# EasyEDA schematic SCH_MODULO_CO2 (Ver 1.0)_2023-02-25.json
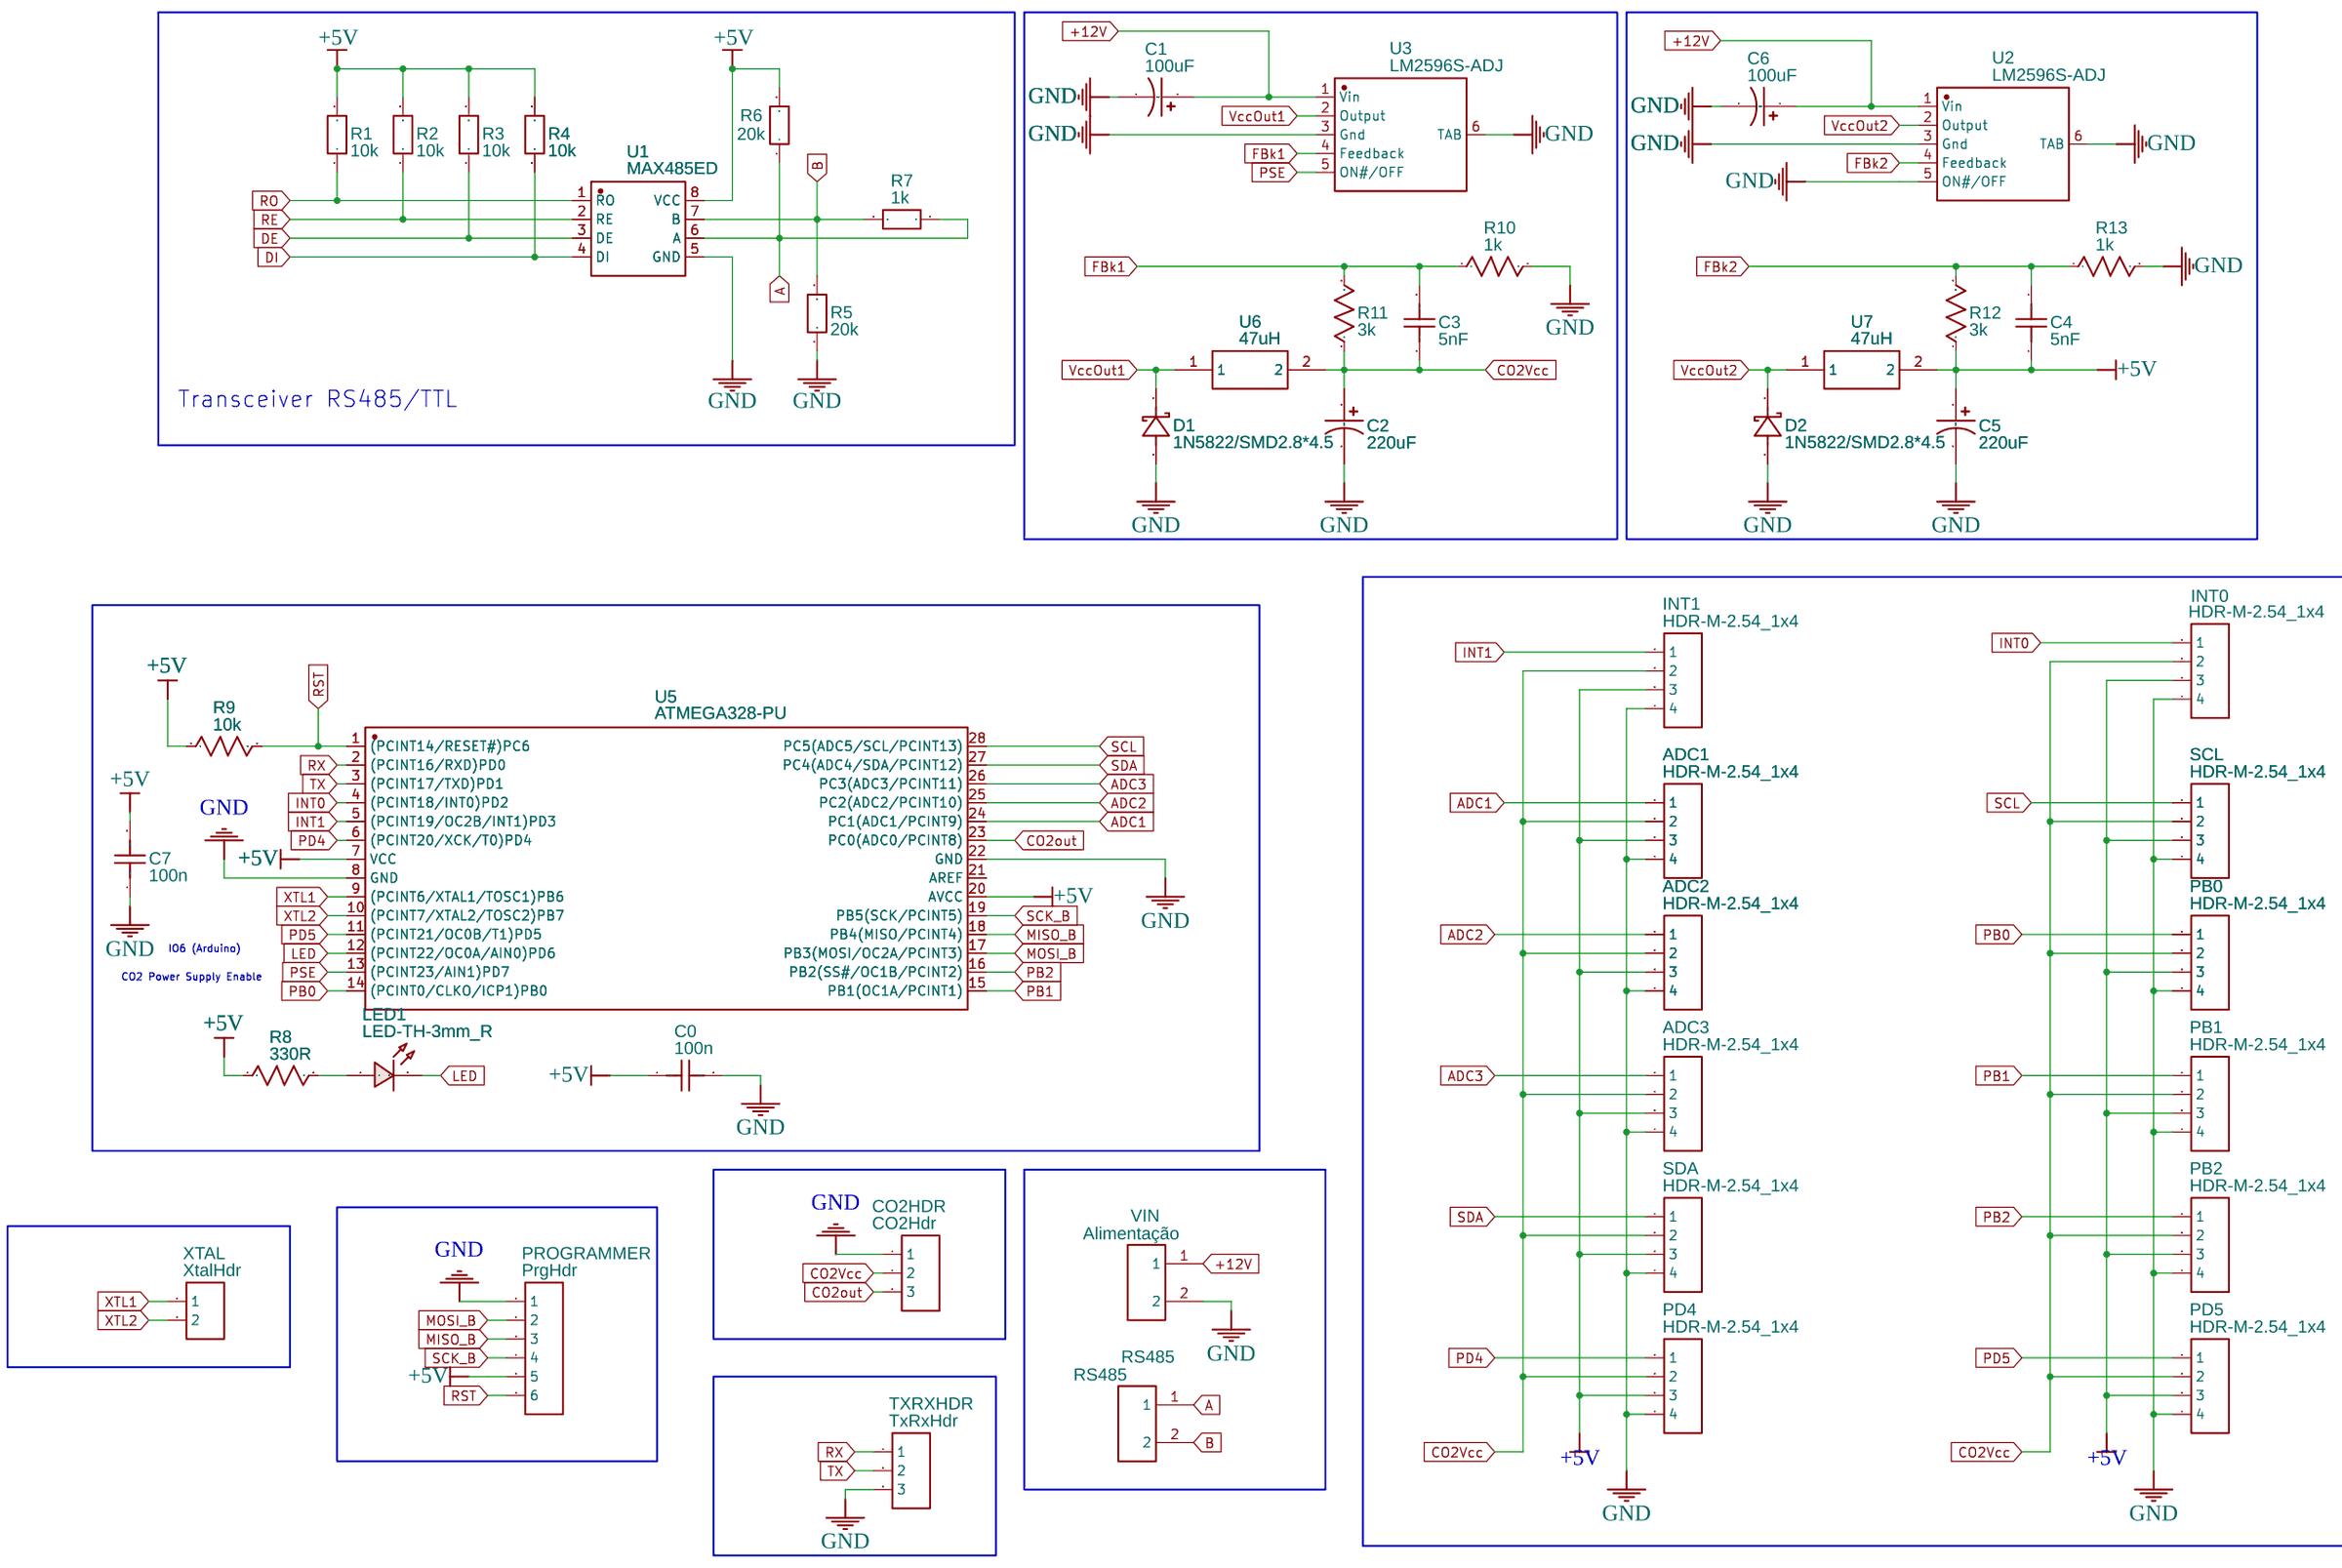
[diagram p0: schematic sheet]

## Parts
ADC1  HDR-M-2.54_1x4  [HDR-M-2.54_1X4]
ADC2  HDR-M-2.54_1x4  [HDR-M-2.54_1X4]
ADC3  HDR-M-2.54_1x4  [HDR-M-2.54_1X4]
C0  100n  [C1206]
C1  100uF  [CAP-D6.3×F2.5]
C2  220uF  [CAP-D6.3×F2.5]
C3  5nF  [C1206]
C4  5nF  [C1206]
C5  220uF  [CAP-D6.3×F2.5]
C6  100uF  [CAP-D6.3×F2.5]
C7  100n  [C1206]
CO2HDR  CO2Hdr  [HDR-F-2.54_1X3]
D1  1N5822/SMD2.8*4.5  [DO-214AC_L4.3-W2.7-LS5.0-RD]
D2  1N5822/SMD2.8*4.5  [DO-214AC_L4.3-W2.7-LS5.0-RD]
INT0  HDR-M-2.54_1x4  [HDR-M-2.54_1X4]
INT1  HDR-M-2.54_1x4  [HDR-M-2.54_1X4]
LED1  LED-TH-3mm_R  [D1206-S-RD]
PB0  HDR-M-2.54_1x4  [HDR-M-2.54_1X4]
PB1  HDR-M-2.54_1x4  [HDR-M-2.54_1X4]
PB2  HDR-M-2.54_1x4  [HDR-M-2.54_1X4]
PD4  HDR-M-2.54_1x4  [HDR-M-2.54_1X4]
PD5  HDR-M-2.54_1x4  [HDR-M-2.54_1X4]
PROGRAMMER  PrgHdr  [HDR-F-2.54_1X6]
R1  10k  [R1206]
R2  10k  [R1206]
R3  10k  [R1206]
R4  10k  [R1206]
R5  20k  [R1206]
R6  20k  [R1206]
R7  1k  [R1206]
R8  330R  [R1206]
R9  10k  [R1206]
R10  1k  [R1206]
R11  3k  [R1206]
R12  3k  [R1206]
R13  1k  [R1206]
RS485  RS485  [CONETOR VERDE 2 PINOS]
SCL  HDR-M-2.54_1x4  [HDR-M-2.54_1X4]
SDA  HDR-M-2.54_1x4  [HDR-M-2.54_1X4]
TXRXHDR  TxRxHdr  [HDR-F-2.54_1X3]
U1  MAX485ED  [SOP-8_L4.9-W3.9-P1.27-LS6.0-BL]
U2  LM2596S-ADJ  [TO-263-5_L10.2-W8.9-P1.70-BR]
U3  LM2596S-ADJ  [TO-263-5_L10.2-W8.9-P1.70-BR]
U5  ATMEGA328-PU  [DIP-28_L35.0-W6.5-P2.54-LS7.6-BL]
U6  47uH  [SMD_INDUCTOR_BIG]
U7  47uH  [SMD_INDUCTOR_BIG]
VIN  Alimentação  [CONETOR VERDE 2 PINOS]
XTAL  XtalHdr  [HDR-F-2.54_1X2]

## Library data of the parts
ADC1-ADC3 INT0 INT1 PB0-PB2 PD4 PD5 SCL SDA = HDR-M-2.54_1x4: Supplier Part: C124378; Supplier: LCSC; Contributor: LCEDA_Lib
C0 = C_RAD-0.1_US: Contributor: LCEDA_Lib
C1 C2 C5 C6 = CE_TH_D6.3×F2.5_US: Contributor: LCEDA_Lib
C3 C4 C7 = C_0603_US: Contributor: LCEDA_Lib
CO2HDR TXRXHDR = HDR-F-2.54_1x3: Supplier Part: C146690; Supplier: LCSC; Contributor: LCEDA_Lib
D1 D2 = 1N5822/SMD2.8*4.5: Supplier: LCSC; Supplier Part: C9900015672; Manufacturer: null; JLCPCB Part Class: Extended Part; Contributor: lcsc
LED1 = LED-TH-3mm_R: Manufacturer: EVERLIGHT(台湾亿光); Manufacturer Part: 204-10SDRD/S530-A3-L; Supplier Part: C84774; Supplier: LCSC; Contributor: LCEDA_Lib
PROGRAMMER = HDR-F-2.54_1x6: Supplier Part: C40877; Supplier: LCSC; Contributor: LCEDA_Lib
R1-R7 = R_1206_EU: Contributor: LCEDA_Lib
R8 R9 = R_AXIAL-0.3_US: Contributor: LCEDA_Lib
R10-R13 = R_1206_US: Contributor: LCEDA_Lib
RS485 VIN = conector verde 2 pinos: Contributor: jpcoelho1974
U1 = MAX485ED: Supplier: LCSC; Supplier Part: C481667; Manufacturer: HTC; Contributor: LCSC; JLCPCB Part Class: Extended Part
U2 U3 = LM2596S-ADJ: Supplier: LCSC; Supplier Part: C347423; Manufacturer: UMW(友台半导体); Contributor: LCSC; JLCPCB Part Class: Extended Part
U5 = ATMEGA328-PU: Supplier: LCSC; Supplier Part: C613508; Manufacturer: MICROCHIP(美国微芯); Contributor: LCSC; JLCPCB Part Class: Extended Part
U6 U7 = smd_inductor_big: Contributor: jpcoelho1974
XTAL = HDR-F-2.54_1x2: Supplier Part: C49661; Supplier: LCSC; Contributor: LCEDA_Lib

## Nets
+5V: ADC1.3 ADC2.3 ADC3.3 C0.1 C4.1 C5.1 C7.2 INT0.3 INT1.3 PB0.3 PB1.3 PB2.3 PD4.3 PD5.3 PROGRAMMER.5 R1.2 R2.2 R3.2 R4.2 R6.2 R8.1 R9.1 R12.1 SCL.3 SDA.3 U1.8(VCC) U5.7(VCC) U5.20(AVCC) U7.2
+12V: C1.1 C6.1 U2.1(Vin) U3.1(Vin) VIN.1
GND: ADC1.4 ADC2.4 ADC3.4 C0.2 C1.2 C2.2 C5.2 C6.2 C7.1 CO2HDR.1 D1.2(K) D2.2(K) INT0.4 INT1.4 PB0.4 PB1.4 PB2.4 PD4.4 PD5.4 PROGRAMMER.1 R5.1 R10.2 R13.2 SCL.4 SDA.4 TXRXHDR.3 U1.5(GND) U2.3(Gnd) U2.5(ON#/OFF) U2.6(TAB) U3.3(Gnd) U3.6(TAB) U5.8(GND) U5.22(GND) VIN.2
VccOut1: D1.1(A) U3.2(Output) U6.1
VccOut2: D2.1(A) U2.2(Output) U7.1
A: R6.1 R7.1 RS485.1 U1.6(A)
ADC1: ADC1.1 U5.24(PC1(ADC1/PCINT9))
ADC2: ADC2.1 U5.25(PC2(ADC2/PCINT10))
ADC3: ADC3.1 U5.26(PC3(ADC3/PCINT11))
B: R5.2 R7.2 RS485.2 U1.7(B)
CO2out: CO2HDR.3 U5.23(PC0(ADC0/PCINT8))
CO2Vcc: ADC1.2 ADC2.2 ADC3.2 C2.1 C3.1 CO2HDR.2 INT0.2 INT1.2 PB0.2 PB1.2 PB2.2 PD4.2 PD5.2 R11.1 SCL.2 SDA.2 U6.2
DE: R3.1 U1.3(DE)
DI: R4.1 U1.4(DI)
FBk1: C3.2 R10.1 R11.2 U3.4(Feedback)
FBk2: C4.2 R12.2 R13.1 U2.4(Feedback)
INT0: INT0.1 U5.4((PCINT18/INT0)PD2)
INT1: INT1.1 U5.5((PCINT19/OC2B/INT1)PD3)
LED: LED1.2 U5.12((PCINT22/OC0A/AIN0)PD6)
MISO_B: PROGRAMMER.3 U5.18(PB4(MISO/PCINT4))
MOSI_B: PROGRAMMER.2 U5.17(PB3(MOSI/OC2A/PCINT3))
PB0: PB0.1 U5.14((PCINT0/CLKO/ICP1)PB0)
PB1: PB1.1 U5.15(PB1(OC1A/PCINT1))
PB2: PB2.1 U5.16(PB2(SS#/OC1B/PCINT2))
PD4: PD4.1 U5.6((PCINT20/XCK/T0)PD4)
PD5: PD5.1 U5.11((PCINT21/OC0B/T1)PD5)
PSE: U3.5(ON#/OFF) U5.13((PCINT23/AIN1)PD7)
RE: R2.1 U1.2(RE)
RO: R1.1 U1.1(RO)
RST: PROGRAMMER.6 R9.2 U5.1((PCINT14/RESET#)PC6)
RX: TXRXHDR.1 U5.2((PCINT16/RXD)PD0)
SCK_B: PROGRAMMER.4 U5.19(PB5(SCK/PCINT5))
SCL: SCL.1 U5.28(PC5(ADC5/SCL/PCINT13))
SDA: SDA.1 U5.27(PC4(ADC4/SDA/PCINT12))
TX: TXRXHDR.2 U5.3((PCINT17/TXD)PD1)
XTL1: U5.9((PCINT6/XTAL1/TOSC1)PB6) XTAL.1
XTL2: U5.10((PCINT7/XTAL2/TOSC2)PB7) XTAL.2
Net-(LED1-1): LED1.1 R8.2

Not connected (* = marked no-connect by the designer): U5 21(AREF)

## Notes on the sheet
- Transceiver RS485/TTL
- IO6 (Arduino)
- CO2 Power Supply Enable
